# EAGLE design atlas_double (EAGLE 8.5.0)
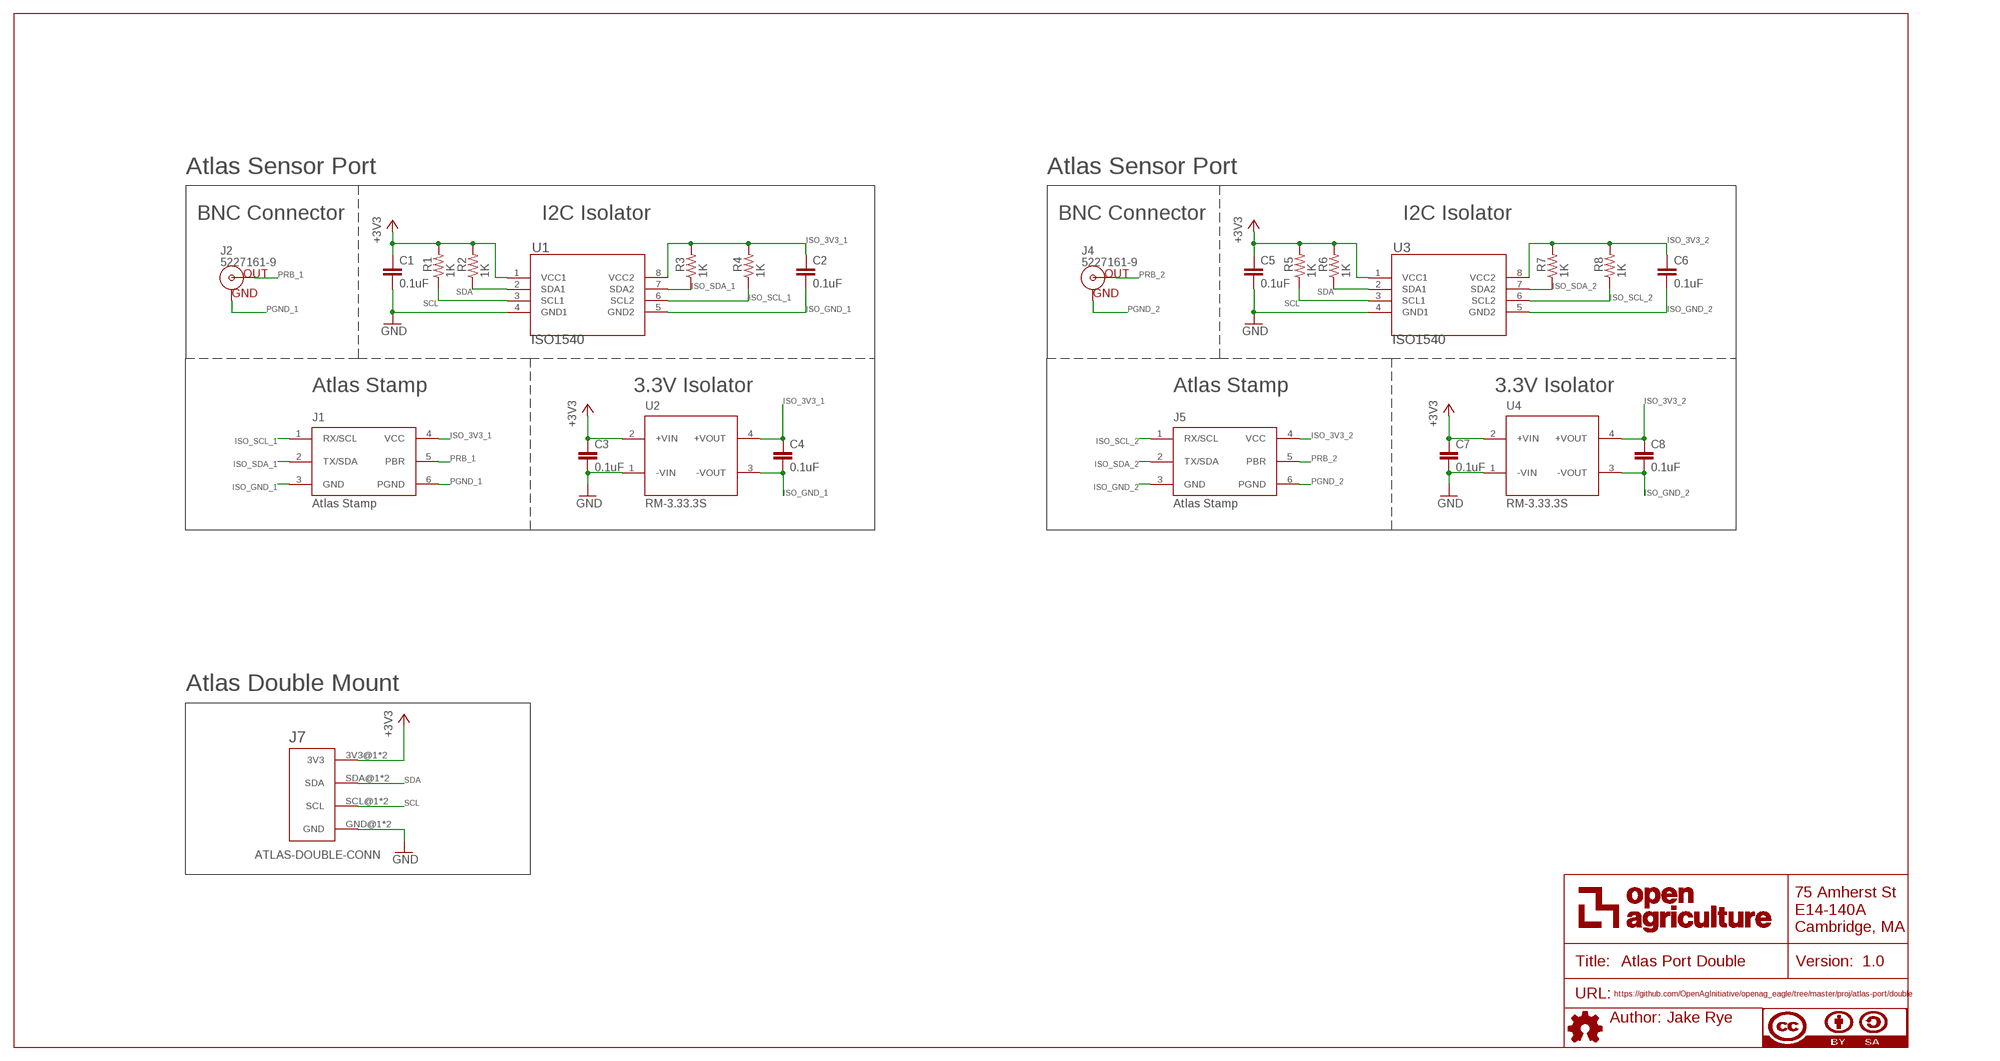
[diagram p0: schematic, sheet 1]
U$4 (DOCFIELD-SCHEMATIC-ONLY): AUTHOR: Jake Rye; MPN: N/A; TITLE: Atlas Port Double; URL: https://github.com/OpenAgInitiative/openag_eagle/tree/master/proj/atlas-port/double; VER: 1.0

## Parts
C1  0.1uF  0.1UF-C0603C104K5RACTU  [C0603]
C2  0.1uF  0.1UF-C0603C104K5RACTU  [C0603]
C3  0.1uF  0.1UF-C0603C104K5RACTU  [C0603]
C4  0.1uF  0.1UF-C0603C104K5RACTU  [C0603]
C5  0.1uF  0.1UF-C0603C104K5RACTU  [C0603]
C6  0.1uF  0.1UF-C0603C104K5RACTU  [C0603]
C7  0.1uF  0.1UF-C0603C104K5RACTU  [C0603]
C8  0.1uF  0.1UF-C0603C104K5RACTU  [C0603]
J1  Atlas Stamp  ATLAS-STAMP  [ATLAS-STAMP]
J2  5227161-9  BNC-5227161-9PTH  [BNC-5227161]
J4  5227161-9  BNC-5227161-9PTH  [BNC-5227161]
J5  Atlas Stamp  ATLAS-STAMP  [ATLAS-STAMP]
J7  ATLAS-DOUBLE-CONN  ATLAS-DOUBLE  [ATLAS-DOUBLE]
R1  1K  1K-ERJ-PB3D1001V  [RC0603N]
R2  1K  1K-ERJ-PB3D1001V  [RC0603N]
R3  1K  1K-ERJ-PB3D1001V  [RC0603N]
R4  1K  1K-ERJ-PB3D1001V  [RC0603N]
R5  1K  1K-ERJ-PB3D1001V  [RC0603N]
R6  1K  1K-ERJ-PB3D1001V  [RC0603N]
R7  1K  1K-ERJ-PB3D1001V  [RC0603N]
R8  1K  1K-ERJ-PB3D1001V  [RC0603N]
U1  ISO1540  ISO1540DR  [D8]
U2  RM-3.33.3S  RM3.33.3S  [RM3.33.3S-SIP4]
U3  ISO1540  ISO1540DR  [D8]
U4  RM-3.33.3S  RM3.33.3S  [RM3.33.3S-SIP4]

## Nets
+3V3: C1.1 C3.1 C5.1 C7.1 J7.3V3@1(3V3) J7.3V3@2(3V3) R1.2 R2.2 R5.2 R6.2 U1.1(VCC1) U2.2(+VIN) U3.1(VCC1) U4.2(+VIN)
GND: C1.2 C3.2 C5.2 C7.2 J7.GND@1(GND) J7.GND@2(GND) U1.4(GND1) U2.1(-VIN) U3.4(GND1) U4.1(-VIN)
ISO_3V3_1: C2.1 C4.1 J1.4(VCC) R3.2 R4.2 U1.8(VCC2) U2.4(+VOUT)
ISO_3V3_2: C6.1 C8.1 J5.4(VCC) R7.2 R8.2 U3.8(VCC2) U4.4(+VOUT)
ISO_GND_1: C2.2 C4.2 J1.3(GND) U1.5(GND2) U2.3(-VOUT)
ISO_GND_2: C6.2 C8.2 J5.3(GND) U3.5(GND2) U4.3(-VOUT)
ISO_SCL_1: J1.1(RX/SCL) R4.1 U1.6(SCL2)
ISO_SCL_2: J5.1(RX/SCL) R8.1 U3.6(SCL2)
ISO_SDA_1: J1.2(TX/SDA) R3.1 U1.7(SDA2)
ISO_SDA_2: J5.2(TX/SDA) R7.1 U3.7(SDA2)
PGND_1: J1.6(PGND) J2.GND
PGND_2: J4.GND J5.6(PGND)
PRB_1: J1.5(PBR) J2.S(OUT)
PRB_2: J4.S(OUT) J5.5(PBR)
SCL: J7.SCL@1(SCL) J7.SCL@2(SCL) R1.1 R5.1 U1.3(SCL1) U3.3(SCL1)
SDA: J7.SDA@1(SDA) J7.SDA@2(SDA) R2.1 R6.1 U1.2(SDA1) U3.2(SDA1)

## Notes on the sheet
- Atlas Sensor Port | Atlas Sensor Port
- BNC Connector | I2C Isolator | BNC Connector | I2C Isolator
- Atlas Stamp | 3.3V Isolator | Atlas Stamp | 3.3V Isolator
- Atlas Double Mount

## Library data of the parts
C1-C8 = openag-capacitors:0.1UF-C0603C104K5RACTU: CAP CER 0.1UF 50V X7R 0603 Description: 0.1µF ±10% 50V Ceramic Capacitor X7R 0603 (1608 Metric) Technical Specifications: Capacitance: 0.1µF Tolerance: ±10% Rated Voltage: 50V Temperature Coefficient: X7R Operating Temperature: -55°C ~ 125°C Package / Case: 0603 (1608 Metric) Datasheet(s): X7R Dielectric, 6.3-250 VDC <https://search.kemet.com/component-edge/download/datasheet/C0603C104K5RACTU.pdf> Vendor(s): Digikey: 399-5089-1-ND <https://www.digikey.com/product-detail/en/kemet/C0603C104K5RACTU/399-5089-1-ND/1465623>; MANUFACTURER: Kemet; MPN: C0603C104K5RACTU; VENDOR: Digikey; VLINK: https://www.digikey.com/product-detail/en/kemet/C0603C104K5RACTU/399-5089-1-ND/1465623; VPN: 399-5089-1-ND
J1 J5 = openag-connectors:ATLAS-STAMP; MPN: N/A
J2 J4 = openag-connectors:BNC-5227161-9: CONN BNC JACK R/A 50 OHM PCB Description: BNC Connector Jack, Female Socket 50 Ohm Panel Mount, Through Hole, Right Angle Solder Technical Specifications: Connector Style: BNC Connector Type: Jack, Female Socket Contact Termination: Solder Shield Termination: Solder Impedance: 50 Ohm Mounting Type: Panel Mount, Through Hole, Right Angle Mounting Feature: Bulkhead - Front Side Nut Fastening Type: Bayonet Lock Frequency - Max: 4GHz Number of Ports: 1 Features: Board Guide, Isolated Housing Color: Black, Silver Body Material: Zinc Body Finish: Nickel Center Contact Plating: Gold Dielectric Material: Polymethylpentene (PMP) Operating Temperature: -55°C ~ 85°C Center Contact Material: Phosphor Bronze Voltage Rating: 500V Mating Cycles: 500 Datasheet(s): 5227161 Drawing <http://www.te.com/commerce/DocumentDelivery/DDEController?Action=srchrtrv&DocNm=5227161&DocType=Customer+Drawing&DocLang=English> Vendor(s): Digikey: A32261-ND <https://www.digikey.com/product-detail/en/te-connectivity-amp-connectors/5227161-9/A32261-ND/811159>; MANUFACTURER: TE Connectivity AMP Connectors; MPN: 5227161-9; VENDOR: Digikey; VLINK: https://www.digikey.com/product-detail/en/te-connectivity-amp-connectors/5227161-9/A32261-ND/811159; VPN: A32261-ND
J7 = openag-connectors:ATLAS-DOUBLE: 100 MIL HEADER I2C CONNECTIONS; MPN: N/A
R1-R8 = openag-resistors:1K-ERJ-PB3D1001V: RES SMD 1K OHM 0.5% 1/5W 0603 Description: 1 kOhms ±0.5% 0.2W, 1/5W Chip Resistor 0603 (1608 Metric) Automotive AEC-Q200, Pulse Withstanding Thick Film Technical Specifications: Resistance: 1 kOhms Tolerance: ±0.5% Power: 0.2W, 1/5W Operating Temperature: -55°C ~ 155°C Package / Case: 0603 (1608 Metric) Datasheet(s): ERJ-PB3, PB6 Series, High Precision Datasheet <https://industrial.panasonic.com/cdbs/www-data/pdf/RDM0000/AOA0000C328.pdf> Vendor(s): Digikey: P20283CT-ND <https://www.digikey.com/product-detail/en/panasonic-electronic-components/ERJ-PB3D1001V/P20283CT-ND/6214538>; MANUFACTURER: Panasonic; MPN: P20283CT-ND; VENDOR: Digikey; VLINK: https://www.digikey.com/product-detail/en/panasonic-electronic-components/ERJ-PB3D1001V/P20283CT-ND/6214538; VPN: P20283CT-ND
U1 U3 = openag-isolators:ISO1540DR: DGTL ISO 2.5KV 2CH I2C 8SOIC Description: I²C Digital Isolator 2500Vrms 2 Channel 1Mbps 25kV/µs CMTI 8-SOIC (0.154", 3.90mm Width) Technical Specifications: Technology: Capacitive Coupling Type: I²C Number of Channels: 2 Channel Type: Bidirectional Voltage-Isolation: 2500Vrms Voltage - Supply: 3 V ~ 5.5 V Data Rate: 1Mbps Operating Temperature: -40°C ~ 125°C Package / Case: 8-SOIC (0.154", 3.90mm Width) Max Supply Current (3V ≤ VCC1, VCC2 ≤ 3.6V) Side 1, Side 2: 3.8mA, 3.1mA Datasheet(s): ISO154x <http://www.ti.com/lit/ds/symlink/iso1540.pdf> Vendor(s): Digikey: 296-34871-1-ND <https://www.digikey.com/product-detail/en/texas-instruments/ISO1540DR/296-34871-1-ND/3587214>; MANUFACTURER: Texas Instruments; MPN: ISO1540DR; VENDOR: Digikey; VLINK: https://www.digikey.com/product-detail/en/texas-instruments/ISO1540DR/296-34871-1-ND/3587214; VPN: 296-34871-1-ND
U2 U4 = openag-isolators:RM3.33.3S: CONV DC/DC 0.25W SGL 3.3VOUT SIP Description: Isolated Module DC DC Converter 1 Output 3.3V 76mA 3V - 3.6V Input Technical Specifications: Type: Isolated Module Number of Outputs: 1 Voltage - Input (Min): 3V Voltage - Input (Max): 3.6V Voltage - Output 1: 3.3V Current - Output (Max): 76mA Power (Watts): 250mW Voltage - Isolation: 1kV Applications: ITE (Commercial) Features: SCP Operating Temperature: -40°C ~ 85°C Efficiency: 70% Mounting Type: Through Hole Package / Case: 4-SIP Module Size / Dimension: 0.45" L x 0.24" W x 0.39" H (11.5mm x 6.0mm x 10.0mm) Datasheet(s): RM Series Datasheet <https://www.recom-power.com/pdf/Econoline/RM.pdf> Vendor(s): Digikey: 945-1212-ND <https://www.digikey.com/product-detail/en/recom-power/RM-3.33.3S/945-1212-ND/2256392>; MANUFACTURER: Recom Power; MPN: RM-3.33.3S; VENDOR: Digikey; VLINK: https://www.digikey.com/product-detail/en/recom-power/RM-3.33.3S/945-1212-ND/2256392; VPN: 945-1212-ND

## Board
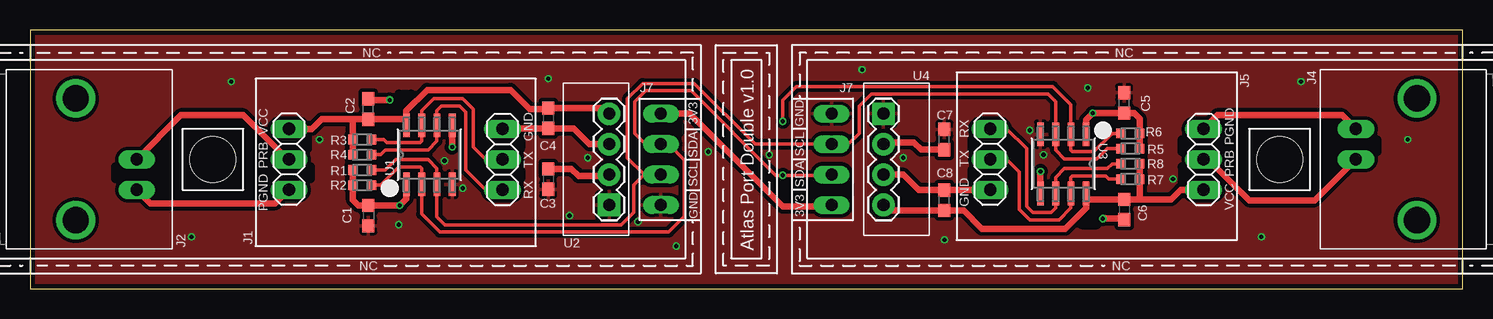
[diagram p1: board, top side]
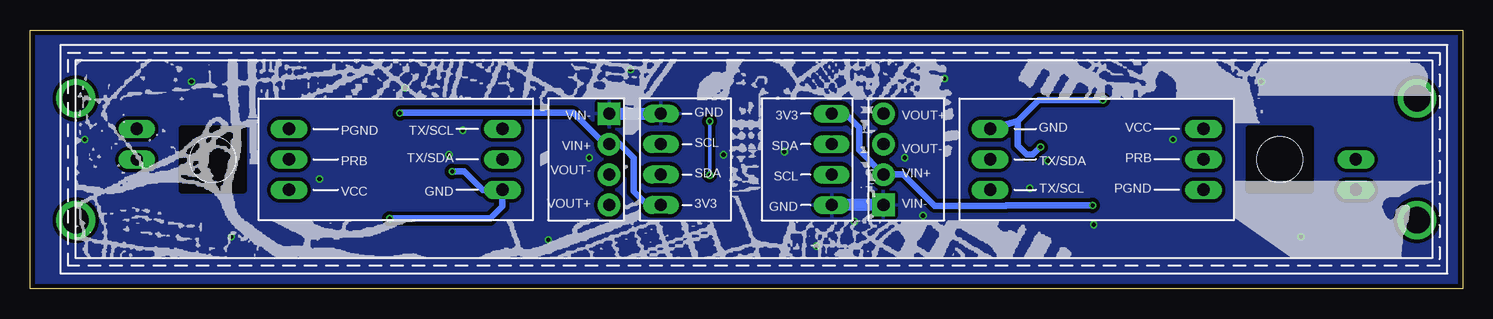
[diagram p2: board, bottom side, seen from below]

Size 119.38 x 21.59 mm. Coordinates in mm from the lower left corner, seen from the top.
Outline: 0,0 119.38,0 119.38,21.59 0,21.59 0,0
Copper layers (1*16): Top 0.035559375mm / dielectric 1.6mm / Bottom 0.035559375mm
Design rules "oshpark-2layer-mask": minimum track width 6mil, minimum drill 10mil, track to track 6mil, track to pad 6mil, pad to pad 6mil, via to via 6mil, smd to smd 6mil, copper to edge 15mil, drill to drill 6mil, minimum pad ring 5mil, minimum via ring 5mil, stop-mask expansion 2.5mil, vias tented up to drill 20mil, thermal gap 10mil
tRestrict: 15 lines

### Footprints (pad centres in the part's own frame; a part is rotated, then mirrored left to right if it is on the bottom)
C0603 = smd 1.1 x 1: 1 -0.85,0; 2 0.85,0
ATLAS-STAMP = drill 1.016 long: 1 -8.89,2.54; 2 -8.89,0; 3 -8.89,-2.54; 4 8.89,-2.54; 5 8.89,0; 6 8.89,2.54
BNC-5227161 = drill 2.2: 3 -5.08,0; 4 5.08,0 | drill 1.016 long: GND -2.54,-5.08; S 0,-5.08
ATLAS-DOUBLE = drill 1 long: 3V3@1 3.81,7.112; 3V3@2 -3.81,-7.112; GND@1 -3.81,7.112; GND@2 3.81,-7.112; SCL@1 -1.27,7.112; SCL@2 1.27,-7.112; SDA@1 1.27,7.112; SDA@2 -1.27,-7.112
RC0603N = smd 0.756 x 0.8: 1 -0.778,0; 2 0.778,0
D8 = smd 1.981 x 0.559: 1 -2.464,1.905; 2 -2.464,0.635; 3 -2.464,-0.635; 4 -2.464,-1.905; 5 2.464,-1.905; 6 2.464,-0.635; 7 2.464,0.635; 8 2.464,1.905
RM3.33.3S-SIP4 = drill 1.016 pad 1.88 square: 1 0,0 | drill 1.016 pad 1.88: 2 2.54,0; 3 5.08,0; 4 7.62,0
HOLE-150 = hole 3.81: 0,0

### Placement (x,y rotation side)
C1  28.19,6.1 270 top
C2  28.19,14.99 90 top
C3  43.18,9.14 270 top
C4  43.18,14.22 270 top
C5  91.19,15.49 90 top
C6  91.19,6.6 270 top
C7  76.2,12.45 90 top
C8  76.2,7.37 90 top
J1  30.48,10.79 180 top
J2  3.81,10.79 90 top
J4  115.57,10.79 270 top
J5  88.9,10.79 0 top
J7  59.69,10.79 270 top
R1  27.69,9.91 180 top
R2  27.69,8.64 180 top
R3  27.69,12.45 180 top
R4  27.69,11.18 180 top
R5  91.69,11.68 0 top
R6  91.69,12.95 0 top
R7  91.69,9.14 0 top
R8  91.69,10.41 0 top
U1  33.27,11.18 90 top
U2  48.26,6.99 90 top
U3  86.11,10.41 270 top
U4  71.12,14.61 270 top
U$1  [HOLE-150]  15.24,10.79 0 top
U$2  [HOLE-150]  104.14,10.79 0 top
U$3  [CAMBRIDGE-MAP-X1-ATLAS-DOUBLE-V-1-0]  0,0 0 top

### Tracks (layer width: path | path; a pad name or v marks a point on that pad's centre or on a via)
+3V3  (via drill 0.35)
  Top 0.508: 43.09,9.91 C3.1 | 76.29,11.68 C7.1
  Top 0.559: C3.1 45.12,9.99 45.72,9.4 48.13,9.4 U2.2 | U1.1 31.37,7.49 v30.82,6.95 C1.1 27.34,6.95 26.91,7.38 R2.2 R1.2 | C7.1 74.26,11.6 73.66,12.19 71.25,12.19 U4.2 | U3.1 88.01,14.1 v88.56,14.64 C5.1 92.04,14.64 92.47,14.21 R6.2 R5.2 | J7.3V3@2 54.99,14.61 62.74,6.86 66.67,6.86 J7.3V3@1
  Bottom 0.559: v30.82,6.95 38.01,6.95 38.05,6.91 43.99,6.91 46.61,9.53 U2.2 50.29,11.56 50.29,13.46 51.44,14.61 J7.3V3@2 | J7.3V3@1 67.94,6.99 69.09,8.13 69.09,10.92 70.23,12.06 U4.2 71.5,12.06 74.12,14.68 88.52,14.68 v88.56,14.64
GND  (via drill 0.35)
  Bottom 1.016: U2.1 J7.GND@2 | U4.1 J7.GND@1
  other vias: 36.07,8.38 30.73,5.33 24.13,12.45 13.46,4.32 16.76,17.27 43.18,17.53 83.31,13.21 88.14,16.76 95.25,9.14 105.92,17.27 102.62,4.32 76.2,4.06 46.48,10.92 34.54,10.67 44.96,6.1 50.67,5.59 56.52,11.43 61.59,11.18 72.77,10.92 84.45,11.18 114.81,12.45 53.85,3.56 69.34,18.29
  pour Top (isolate 0.305, rank 3): 0,0 119.38,0 119.38,21.59 0,21.59
  pour Bottom (isolate 0.305, rank 3): 0,0 119.38,0 119.38,21.59 0,21.59
  pour Bottom (isolate 0.305, rank 2): 55.88,1.27 1.27,1.27 1.27,20.32 55.88,20.32
  pour Top (isolate 0.305, rank 2): 1.27,1.27 1.27,20.32 55.88,20.32 55.88,1.27
  pour Bottom (isolate 0.305, rank 2): 62.23,20.32 116.84,20.32 116.84,1.27 62.23,1.27
  pour Top (isolate 0.305, rank 2): 118.11,20.32 118.11,1.27 63.5,1.27 63.5,20.32
ISO_3V3_1
  Top 0.559: J1.4 23.5,13.34 24.3,14.14 26.92,14.14 | 26.92,14.14 C2.1 31.37,14.14 U1.8 31.37,14.86 33.1,16.59 40.06,16.59 41.66,14.99 43.09,14.99 C4.1 47.79,15.07 U2.4 | 26.92,14.14 26.91,14.12 R3.2 R4.2
ISO_3V3_2
  Top 0.559: 92.46,7.45 95.08,7.45 95.89,8.26 J5.4 | 92.46,7.45 C6.1 88.01,7.45 U3.8 88.01,6.73 86.28,5 79.32,5 77.81,6.52 C8.1 71.59,6.52 U4.4 | 92.46,7.45 92.47,7.47 R7.2 R8.2
ISO_GND_1  (via drill 0.35)
  Top 0.559: U1.5 v35.18,11.81 | v29.97,15.75 28.28,15.75 C2.2 | U2.3 46.61,12.06 45.3,13.37 C4.2 39.41,13.37 J1.3
  Bottom 0.559: v35.18,11.81 35.81,11.18 36.32,11.18 37.08,11.94 37.08,13.97 | 37.08,13.97 J1.3 | 37.08,13.97 35.31,15.75 v29.97,15.75
ISO_GND_2  (via drill 0.35)
  Top 0.559: U4.3 72.77,9.53 74.08,8.22 C8.2 79.97,8.22 J5.3 | U3.5 v84.2,9.78 | v89.41,5.84 91.1,5.84 C6.2
  Bottom 0.559: 81.03,8.13 80.9,8.26 J5.3 | v84.2,9.78 83.19,9.78 81.66,8.26 J5.3 | J5.3 80.01,6.86 81.03,5.84 v89.41,5.84
ISO_SCL_1
  Top 0.305: J1.1 37.97,8.26 36.32,9.91 36.32,14.73 35.81,15.24 34.29,15.24 33.91,14.86 U1.6 33.91,12.32 33.17,11.58 29.62,11.58 29.21,11.18 R4.1
ISO_SCL_2
  Top 0.305: J5.1 81.41,13.34 83.06,11.68 83.06,6.86 83.57,6.35 85.09,6.35 85.47,6.73 U3.6 85.47,9.27 86.21,10.01 89.76,10.01 90.17,10.41 R8.1
ISO_SDA_1
  Top 0.305: R3.1 29.46,12.45 29.72,12.19 32.51,12.19 32.64,12.32 U1.7 32.64,14.86 33.63,15.85 36.07,15.85 36.93,14.98 36.93,11.84 37.97,10.79 J1.2
ISO_SDA_2
  Top 0.305: R7.1 89.92,9.14 89.66,9.4 86.87,9.4 86.74,9.27 U3.7 86.74,6.73 85.75,5.74 83.31,5.74 82.45,6.61 82.45,9.75 81.41,10.79 J5.2
PGND_1
  Top 0.559: J2.GND 10.03,7.11 20.45,7.11 J1.6
PGND_2
  Top 0.559: J4.GND 109.35,14.48 98.93,14.48 J5.6
PRB_1
  Top 0.559: J1.5 21.46,10.79 17.78,14.48 12.57,14.48 J2.S
PRB_2
  Top 0.559: J5.5 98.17,10.79 101.6,7.37 107.06,7.37 J4.S
SCL
  Top 0.305: R1.1 29.62,9.91 30.48,10.77 33.17,10.77 33.91,10.03 U1.3 33.91,5.97 34.54,5.33 49.28,5.33 50.29,6.35 50.29,8.64 51.18,9.53 | R5.1 89.76,11.68 88.9,10.82 86.21,10.82 85.47,11.56 U3.3 85.47,15.62 84.84,16.26 70.1,16.26 69.09,15.24 69.09,12.95 68.2,12.06 J7.SCL@1 60.42,12.06 55.37,17.12 51.05,17.12 49.78,15.85 49.78,10.92 51.18,9.53 | 51.18,9.53 J7.SCL@2
SDA  (via drill 0.35)
  Top 0.305: v62.74,13.97 62.74,15.75 63.86,16.87 85.24,16.87 86.74,15.37 U3.2 86.74,11.56 86.87,11.43 88.65,11.43 90.17,12.95 R6.1 | R2.1 29.21,8.64 30.73,10.16 32.51,10.16 32.64,10.03 U1.2 32.64,6.22 34.14,4.72 53.24,4.72 54.53,6.02 54.53,10.74 53.21,12.06 J7.SDA@2 51.28,12.06 50.39,12.95 50.39,15.6 51.31,16.51 55.12,16.51 62.17,9.46 v62.74,9.46 66.74,9.46 J7.SDA@1
  Bottom 0.305: v62.74,13.97 v62.74,9.46

### Text on the board
tPlace: NC | NC | EDGE | EDGE | Atlas Port Double v1.0 | NC | NC